# Altium schematic sheet Wenzel_Arduino.SchDoc: =SheetTitle_Top
size 420 x 297 mm; EDA_Number: ARTIQ; Projet: Wenzel; Author: G.Kasprowicz; CompanyName: WUT ISE; DrawnBy: G.Kasprowicz; Organization: WUT ISE; Address1: PW ISE; Address2: Nowowiejska 15/19 00-665 Warsaw; Address3: gkasprow@gmail.com; SheetNumber: -; SheetTotal: -; ModifiedBy: -; CheckedDate: -; Title2: Arduino; DivGrp: WUT ISE; Designer: G.Kasprowicz; ModifiedDate: -; ProjectName: Sensor Box
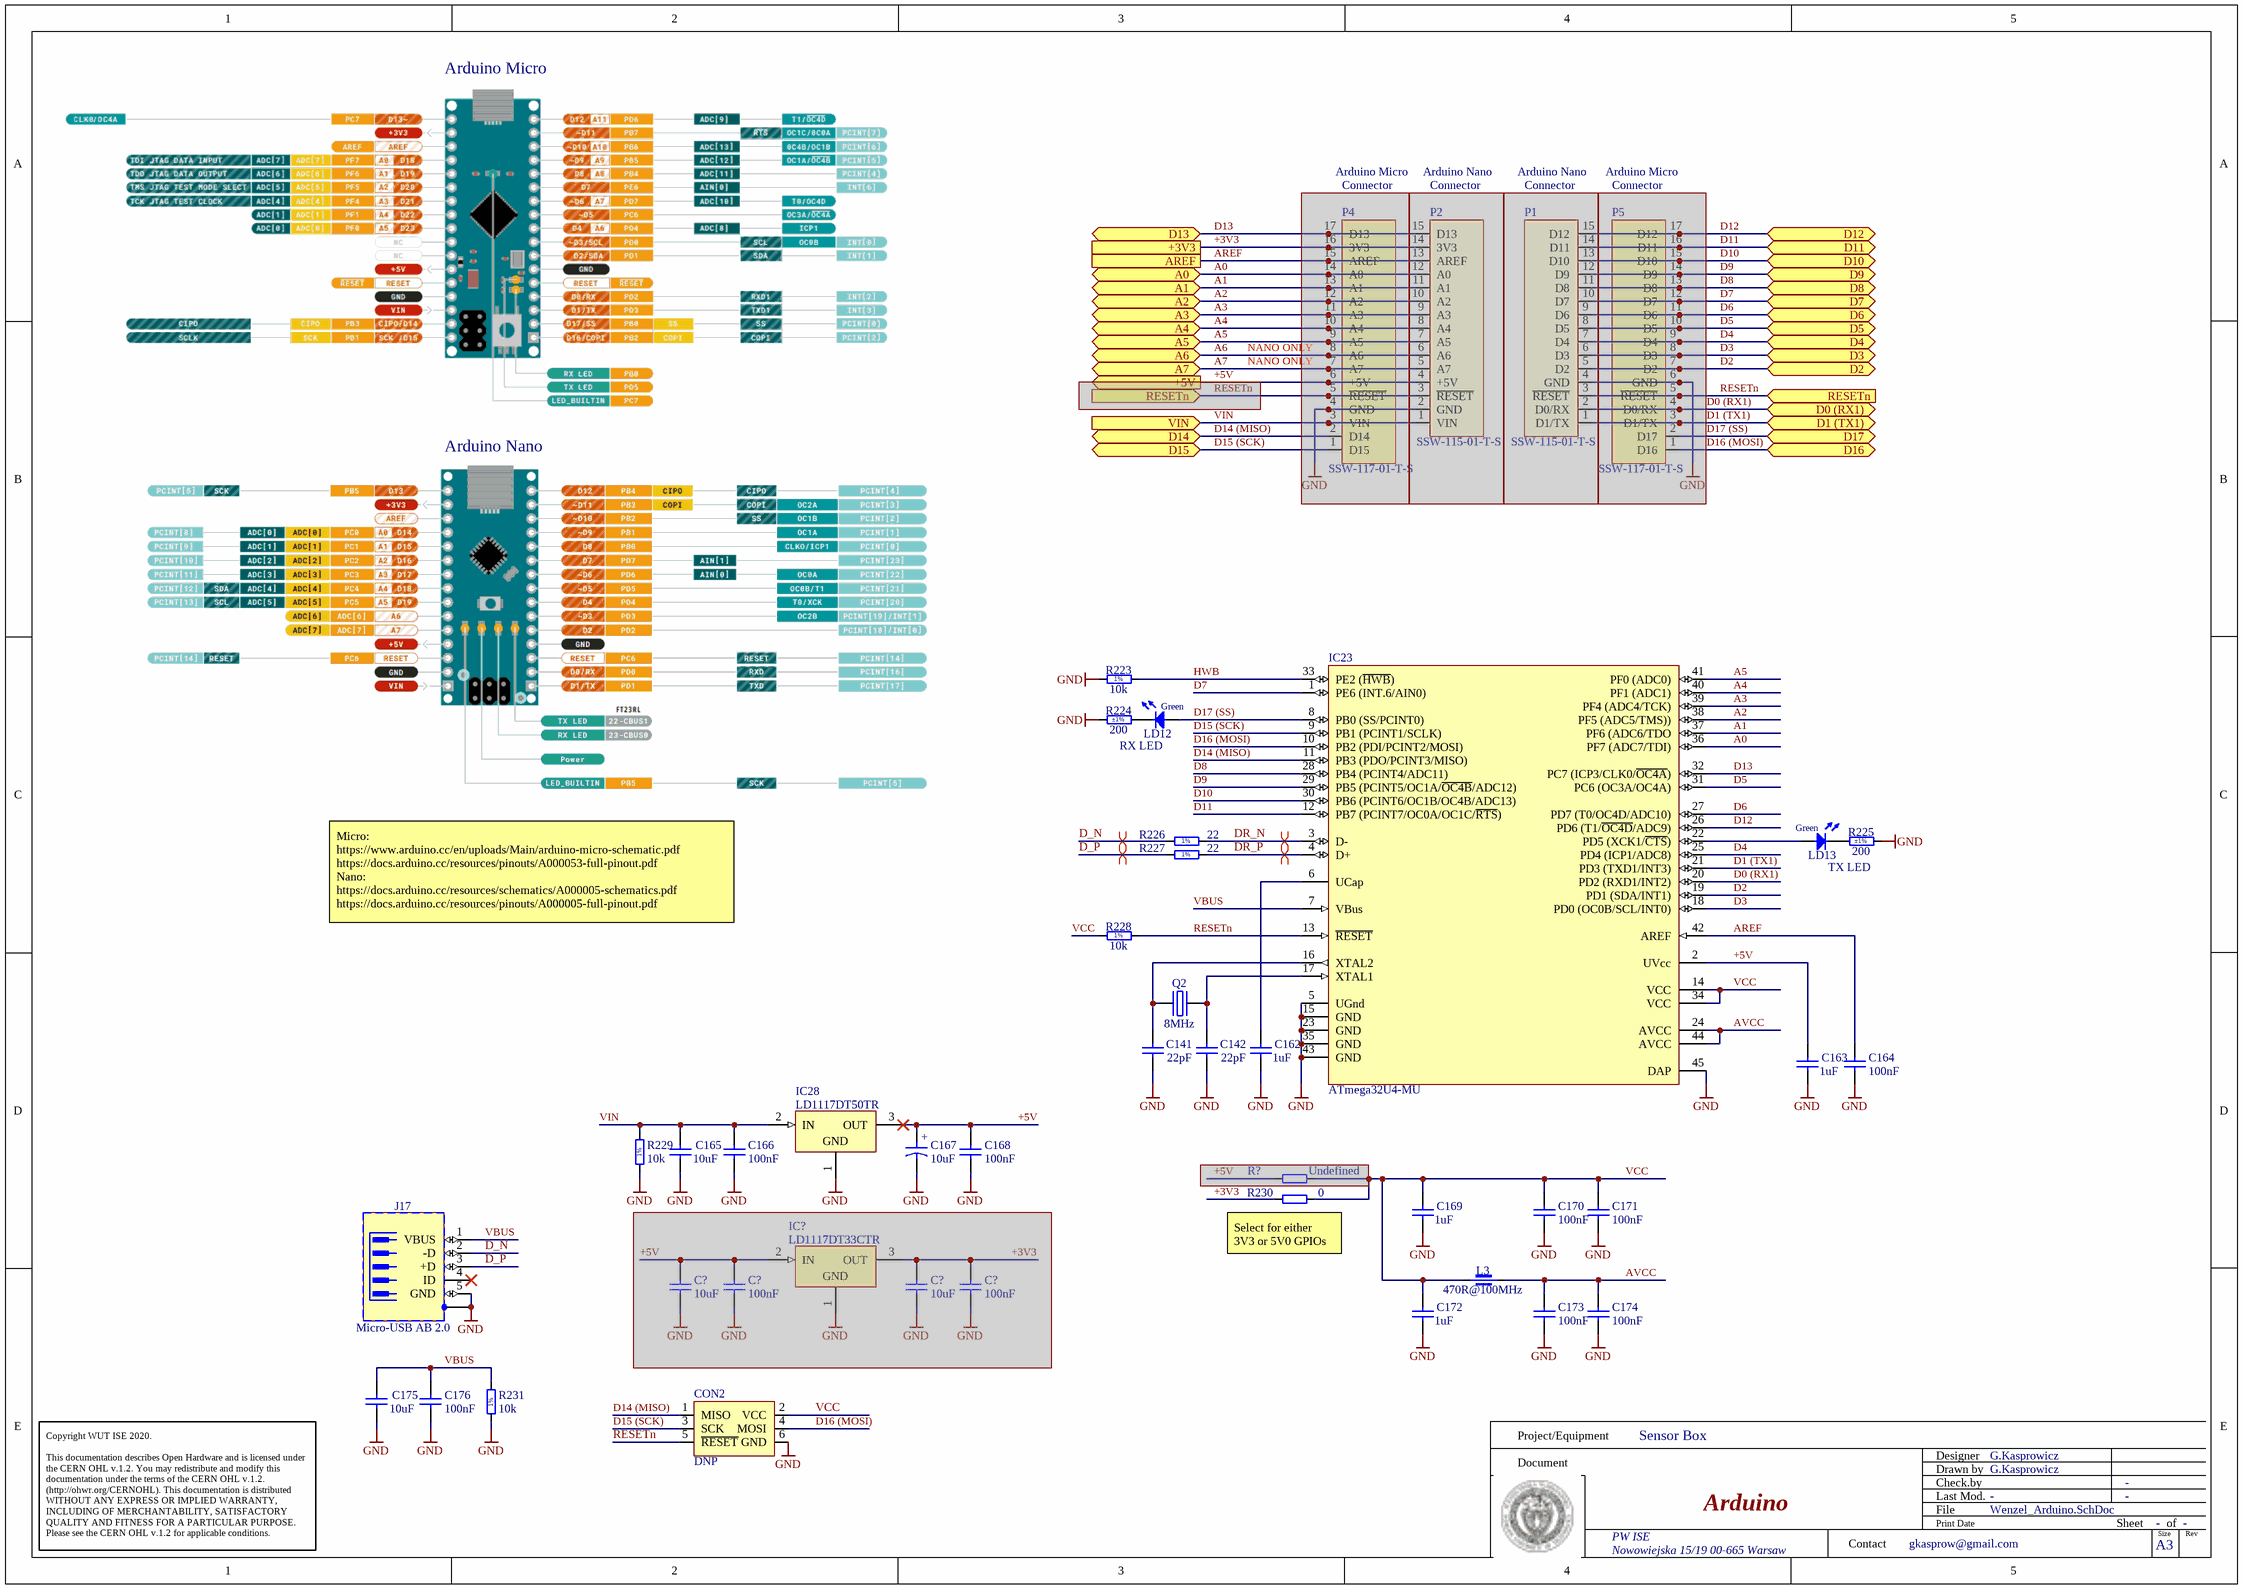
[diagram p0: Wenzel_Arduino.SchDoc]

## Parts
(Parts that share a designator on the sheet are numbered #1, #2 ... from top to bottom, then left to right.)
C141  22pF  [CAPC1005X55N]
C142  22pF  [CAPC1005X55N]
C162  1uF  [CAPC1005X55N]
C163  1uF  [CAPC1005X55N]
C164  100nF  [CAPC1005X55N]
C165  10uF  [CAPC1608X80N]
C166  100nF  [CAPC1005X55N]
C167  10uF  [CAPMP3216X180N]
C168  100nF  [CAPC1005X55N]
C169  1uF  [CAPC1005X55N]
C170  100nF  [CAPC1005X55N]
C171  100nF  [CAPC1005X55N]
C172  1uF  [CAPC1005X55N]
C173  100nF  [CAPC1005X55N]
C174  100nF  [CAPC1005X55N]
C175  10uF  [CAPC1608X80N]
C176  100nF  [CAPC1005X55N]
C?#1  100nF  [CAPC1608X87N]  (masked out: inside a compile mask, not in the netlist)
C?#2  100nF  [CAPC1608X87N]  (masked out: inside a compile mask, not in the netlist)
C?#3  10uF  [CAPC1608X80N]  (masked out: inside a compile mask, not in the netlist)
C?#4  10uF  [CAPC1608X80N]  (masked out: inside a compile mask, not in the netlist)
CON2  DNP  [HEADER3x2]
IC23  ATmega32U4-MU  [44PW_M]
IC28  LD1117DT50TR  [TO228P972X240-3N-R540X510]
IC?  LD1117DT33CTR  [TO228P972X240-3N-R540X510]  (masked out: inside a compile mask, not in the netlist)
J17  Micro-USB AB 2.0  [HIROSE_ZX62RD-AB-5P8]
L3  470R@100MHz  [INDC1608X95N]
LD12  Green  [LED_KINGBRIGHT_KPH-1608CGCK]
LD13  Green  [LED_KINGBRIGHT_KPH-1608CGCK]
P1  SSW-115-01-T-S  [SSW-115-01-T-S]  (masked out: inside a compile mask, not in the netlist)
P2  SSW-115-01-T-S  [SSW-115-01-T-S]  (masked out: inside a compile mask, not in the netlist)
P4  SSW-117-01-T-S  [SSW-117-01-T-S]  (masked out: inside a compile mask, not in the netlist)
P5  SSW-117-01-T-S  [SSW-117-01-T-S]  (masked out: inside a compile mask, not in the netlist)
Q2  8MHz  [XTAL_TXC_7A]
R223  10k  [RESC1608X55N]
R224  200  Tolerance: ±1%  [RESC1005X40N]
R225  200  Tolerance: ±1%  [RESC1005X40N]
R226  22  [RESC1005X40N]
R227  22  [RESC1005X40N]
R228  10k  [RESC1608X55N]
R229  10k  [RESC1608X55N]
R230  0  [RESC1005X40N]
R231  10k  [RESC1608X55N]
R?  Undefined  [RESC1005X40N]  (masked out: inside a compile mask, not in the netlist)

## Ports
+3V3, +5V (out), A0 (bidir), A1 (bidir), A2 (bidir), A3 (bidir), A4 (bidir), A5 (bidir), A6 (bidir), A7 (bidir), AREF, D0 (RX1) (bidir), D1 (TX1) (bidir), D2 (bidir), D3 (bidir), D4 (bidir), D5 (bidir), D6 (bidir), D7 (bidir), D8 (bidir), D9 (bidir), D10 (bidir), D11 (bidir), D12 (bidir), D13 (bidir), D14 (bidir), D15 (bidir), D16 (bidir), D17 (bidir), RESETn (in), VIN (in)

## Nets
GND: C141.1 C142.1 C162.1 C163.1 C164.1 C165.1 C166.1 C167.2 C168.1 C169.1 C170.1 C171.1 C172.1 C173.1 C174.1 C175.1 C176.1 CON2.6(GND) IC23.5(UGnd) IC23.15(GND) IC23.23(GND) IC23.35(GND) IC23.43(GND) IC23.45(DAP) IC28.1(GND) J17.5(GND) J17.6(SH) R223.1 R224.1 R225.2 R229.1 R231.1
+3V3: R230.2 ; port +3V3
+5V: C163.2 C167.1 C168.2 IC23.2(UVcc) IC28.3(OUT)
A0: IC23.36(PF7_(ADC7/TDI)) ; port A0
A1: IC23.37(PF6_(ADC6/TDO) ; port A1
A2: IC23.38(PF5_(ADC5/TMS))) ; port A2
A3: IC23.39(PF4_(ADC4/TCK)) ; port A3
A4: IC23.40(PF1_(ADC1)) ; port A4
A5: IC23.41(PF0_(ADC0)) ; port A5
A6: port A6
A7: port A7
AREF: C164.2 IC23.42(AREF) ; port AREF
AVCC: C173.2 C174.2 IC23.24(AVCC) IC23.44(AVCC) L3.2
D0 (RX1): IC23.20(PD2_(RXD1/INT2))
D1 (TX1): IC23.21(PD3_(TXD1/INT3))
D2: IC23.19(PD1_(SDA/INT1)) ; port D2
D3: IC23.18(PD0_(OC0B/SCL/INT0)) ; port D3
D4: IC23.25(PD4_(ICP1/ADC8)) ; port D4
D5: IC23.31(PC6_(OC3A/OC4A)) ; port D5
D6: IC23.27(PD7_(T0/OC4D/ADC10)) ; port D6
D7: IC23.1(PE6_(INT.6/AIN0)) ; port D7
D8: IC23.28(PB4_(PCINT4/ADC11)) ; port D8
D9: IC23.29(PB5_(PCINT5/OC1A/~{OC4B}/ADC12)) ; port D9
D10: IC23.30(PB6_(PCINT6/OC1B/OC4B/ADC13)) ; port D10
D11: IC23.12(PB7_(PCINT7/OC0A/OC1C/~{RTS})) ; port D11
D12: IC23.26(PD6_(T1/~{OC4D}/ADC9)) ; port D12
D13: IC23.32(PC7_(ICP3/CLK0/~{OC4A})) ; port D13
D14 (MISO): CON2.1(MISO) IC23.11(PB3_(PDO/PCINT3/MISO)) ; port D14
D15 (SCK): CON2.3(SCK) IC23.9(PB1_(PCINT1/SCLK)) ; port D15
D16 (MOSI): CON2.4(MOSI) IC23.10(PB2_(PDI/PCINT2/MOSI))
D17 (SS): IC23.8(PB0_(SS/PCINT0)) LD12.2(A)
D_N: J17.2(-D) R226.1
D_P: J17.3(+D) R227.1
DR_N: IC23.3(D-) R226.2
DR_P: IC23.4(D+) R227.2
HWB: IC23.33(PE2_(~{HWB})) R223.2
RESETn: CON2.5(~{RESET}) IC23.13(~{RESET}) R228.2 ; port RESETn
VBUS: C175.2 C176.2 IC23.7(VBus) J17.1(VBUS) R231.2
VCC: C169.2 C170.2 C171.2 C172.2 CON2.2(VCC) IC23.14(VCC) IC23.34(VCC) L3.1 R228.1 R230.1
VIN: C165.2 C166.2 IC28.2(IN) R229.2 ; port VIN
NetC141_2: C141.2 IC23.16(XTAL2) Q2.1(OSC1)
NetC142_2: C142.2 IC23.17(XTAL1) Q2.2(OSC2)
NetC162_2: C162.2 IC23.6(UCap)
NetIC23_22: IC23.22(PD5_(XCK1/~{CTS})) LD13.2(A)
NetLD12_1: LD12.1(C) R224.2
NetLD13_1: LD13.1(C) R225.1

Not connected (* = marked no-connect by the designer): J17 4(ID)*

## Layout directives
differential pair: D_N, D_P, DR_N, DR_P

## Notes on the sheet
- Arduino Micro
- Connector
- Arduino Nano
- (near P2) Connector
- (near P1) Connector
- (near P4) NANO ONLY
- RX LED
- Micro:
  https://www.arduino.cc/en/uploads/Main/arduino-micro-schematic.pdf
  https://docs.arduino.cc/resources/pinouts/A000053-full-pinout.pdf
  Nano:
  https://docs.arduino.cc/resources/schematics/A000005-schematics.pdf
  https://docs.arduino.cc/resources/pinouts/A000005-full-pinout.pdf
- TX LED
- (near R230) Select for either 3V3 or 5V0 GPIOs
- Project/Equipment
- Document
- Designer
- Drawn by
- Check.by
- Copyright WUT ISE 2020.
  This documentation describes Open Hardware and is licensed under the CERN OHL v.1.2. You may redistribute and modify this documentation under the terms of the CERN OHL v.1.2. (http://ohwr.org/CERNOHL). This documentation is distributed WITHOUT ANY EXPRESS OR IMPLIED WARRANTY, INCLUDING OF MERCHANTABILITY, SATISFACTORY QUALITY AND FITNESS FOR A PARTICULAR PURPOSE. Please see the CERN OHL v.1.2 for applicable conditions.
- Contact
- File
- Last Mod.
- Print Date
- Sheet
- Size
- A3
- of
- Rev
- (in symbol CTE3216-18_10UF_16V_20%_AVX_TCJ) +
- (in symbol R0402_22R_1%_0.0625W_100PPM) 1%
- (in symbol R0603_10K_1%_0.1W_100PPM) 1%

## Library data of the parts
C141 C142 = CC0402_22PF_50V_5%_C0G: Non-polarised capacitor; Part Description: SMD Multilayer Chip Ceramic Capacitor; Manufacturer: GENERIC; Manufacturer1 Part Number: C0402C220J5GACTU; Voltage: 50V; TC: C0G/NP0; Tolerance: ±5%; Part Number: CC0402_22PF_50V_5%_C0G; Component Kind: Standard; Component Type: Standard; Pin Count: 2; Value: 22pF; Status: Preferred; Manufacturer Part Number: CC0402_22PF_50V_5%_C0G; Case: 0402; Mounted: Yes; Socket: No; SMD: Yes; Manufacturer1 Example: KEMET; Manufacturer1 ComponentHeight: 0.55mm; HelpURL: \\cern.ch\dfs\Applications\Altium\Datasheets\CC0402_C0G_KEMET_(Commercial Grade).pdf; Author: CERN DEM JLC; CreateDate: 2007-12-03; LatestRevisionDate: 2007-12-03; Sense: No
C162 C163 C169 C172 = CC0402_1UF_16V_10%_X5R: Non-polarised capacitor; Part Description: SMD Multilayer Chip Ceramic Capacitor; Manufacturer: GENERIC; Manufacturer1 Part Number: C1005X5R1C105KT; Voltage: 16V; TC: X5R; Tolerance: ±10%; Part Number: CC0402_1UF_16V_10%_X5R; Component Kind: Standard; Component Type: Standard; Pin Count: 2; Value: 1uF; Status: Preferred; Manufacturer Part Number: CC0402_1UF_16V_10%_X5R; Case: 0402; Mounted: Yes; Socket: No; SMD: Yes; Sense: No; Manufacturer1 Example: TDK; Manufacturer1 ComponentHeight: 0.55mm; HelpURL: \\cern.ch\dfs\Applications\Altium\Datasheets\CC0402_X5R_TDK_C.pdf; Author: CERN DEM JLC; CreateDate: 2012-10-25; LatestRevisionDate: 2012-10-25
C164 C166 C168 C170 C171 C173 C174 C176 = CC0402_100NF_16V_10%_X5R: Non-polarised capacitor; Part Description: SMD Multilayer Chip Ceramic Capacitor; Manufacturer: GENERIC; Manufacturer1 Part Number: GRM155R61C104KA88D; Voltage: 16V; TC: X5R; Tolerance: ±10%; Part Number: CC0402_100NF_16V_10%_X5R; Component Kind: Standard; Component Type: Standard; Pin Count: 2; Value: 100nF; Status: None; Manufacturer Part Number: CC0402_100NF_16V_10%_X5R; Case: 0402; Mounted: Yes; Socket: No; SMD: Yes; Sense: No; Manufacturer1 Example: MURATA; Manufacturer1 ComponentHeight: 0.55mm; HelpURL: \\cern.ch\dfs\Applications\Altium\Datasheets\CC0402_X5R_MURATA_GRM.pdf; Author: CERN DEM JLC; CreateDate: 10.12.2013; LatestRevisionDate: 10.12.2013
C165 C175 = CC0603_10UF_16V_20%_X5R: Non-polarised capacitor; Part Description: SMD Multilayer Chip Ceramic Capacitor; Manufacturer: GENERIC; Manufacturer1 Part Number: GRM188R61C106MA73D; Voltage: 16V; TC: X5R; Tolerance: ±20%; Part Number: CC0603_10UF_16V_20%_X5R; Component Kind: Standard; Component Type: Standard; Pin Count: 2; Value: 10uF; Status: None; Manufacturer Part Number: CC0603_10UF_16V_20%_X5R; Case: 0603; Mounted: Yes; Socket: No; SMD: Yes; Sense: No; Manufacturer1 Example: MURATA; Manufacturer1 ComponentHeight: 0.8mm; HelpURL: \\cern.ch\dfs\Applications\Altium\Datasheets\CC0603_X5R_MURATA_GRM.pdf; Author: CERN DEM MR; CreateDate: 02.03.2016; LatestRevisionDate: 02.03.2016
C167 = CTE3216-18_10UF_16V_20%_AVX_TCJ: Polarised capacitor; Part Description: ESR 0R200 Tantalum Solid Electrolytic Chip Capacitor with Conductive Polymer Electrode; Manufacturer: AVX; Manufacturer Part Number: TCJA106M016R0200 or  or TR3A106K016C1700; Voltage: 16V; Tolerance: ±20%; Part Number: CTE3216-18_10UF_16V_20%_AVX_TCJ; Component Kind: Standard; Component Type: Standard; Pin Count: 2; Value: 10uF; Status: Preferred; Case: A; Mounted: Yes; Socket: No; SMD: Yes; Sense: No; HelpURL: \\cern.ch\dfs\Applications\Altium\Datasheets\CTE_AVX_TCJ.pdf; Author: CERN DEM JLC; CreateDate: 29.03.2012; LatestRevisionDate: 29.03.2012; ComponentHeight: 1.8mm
C?#1 C?#2 = CC0603_100NF_50V_10%_X5R: Non-polarised capacitor; Part Description: SMD Multilayer Chip Ceramic Capacitor; Manufacturer: GENERIC; Manufacturer1 Part Number: C1608X5R1H104K080AA; Voltage: 50V; TC: X5R; Tolerance: ±10%; Part Number: CC0603_100NF_50V_10%_X5R; Component Kind: Standard; Component Type: Standard; Pin Count: 2; Value: 100nF; Status: None; Manufacturer Part Number: CC0603_100NF_50V_10%_X5R; Case: 0603; Mounted: Yes; Socket: No; SMD: Yes; Sense: No; Manufacturer1 Example: TDK; Manufacturer1 ComponentHeight: 0.9mm; HelpURL: \\cern.ch\dfs\Applications\Altium\Datasheets\CC0603_X5R_TDK_C.pdf; Author: CERN DEM MR; CreateDate: 08.01.2016; LatestRevisionDate: 08.01.2016
C?#3 C?#4 = CC0603_10UF_10V_10%_X5R: Non-polarised capacitor; Part Description: SMD Multilayer Chip Ceramic Capacitor; Manufacturer: GENERIC; Manufacturer1 Part Number: GRM188R61A106KE69D; Voltage: 10V; TC: X5R; Tolerance: ±10%; Part Number: CC0603_10UF_10V_10%_X5R; Component Kind: Standard; Component Type: Standard; Pin Count: 2; Value: 10uF; Status: None; Manufacturer Part Number: CC0603_10UF_10V_10%_X5R; Case: 0603; Mounted: Yes; Socket: No; SMD: Yes; Sense: No; Manufacturer1 Example: MURATA; Manufacturer1 ComponentHeight: 0.8mm; HelpURL: \\cern.ch\dfs\Applications\Altium\Datasheets\CC0603_MURATA_GRM188R61A106KE69D.pdf; Author: CERN DEM JLC; CreateDate: 31.01.2017; LatestRevisionDate: 31.01.2017
CON2 = CON_ISP: 6x 2.54mm SMT  dual row pin header
IC23 = CMP-0095-00166-2: 8-bit AVR Microcontroller, 2.7-5.5V, 16MHz, 32KB Flash, 1KB EEPROM, 2.5KB SRAM, USB Controller, 44-pin QFN, Industrial Grade (-40°C to 85°C), Ext Osc; Manufacturer: Microchip; PackageVersion: revG, Sep-2009; PackageReference: 44PW; ComponentLink1URL: http://www.atmel.com/; PackageDescription: 44-Pin Quad Flat No-Lead Package, 7 x 7 mm Body, 0.5 mm Pitch (QFN); ComponentLink3Description: ATmega16U4 ATmega32U4 Summary; RevisionNote: DatasheetVersion, PackageVersion & PCB updated. URLs added.; ComponentLink2Description: ATmega16U4/32U4 Datasheet; ComponentLink1Description: Manufacturer URL; ComponentLink3URL: http://www.atmel.com/dyn/resources/prod_documents/7766S.pdf; DatasheetVersion: revF, Nov-2010; ComponentLink2URL: http://www.atmel.com/dyn/resources/prod_documents/doc7766.pdf; Code_JEDEC: MO-220-VKKD-1; Part Number: ATmega32U4-MU; Manufacturer Part Number: ATmega32U4-MU
IC28 = LD1117DT50TR: 3-Terminal Regulator 1=GND 2=IN 3=OUT; Part Description: 5V 800mA Low drop fixed positive voltage regulators; Manufacturer: ST MICROELECTRONICS; PressFit: No; Bonding: No; Part Number: LD1117DT50TR; Component Kind: Standard; Component Type: Standard; Device: LD1117DT50TR; PackageDescription: TO-252 DPAK TO, 2.28mm Pitch; 2 Pin, 9.725mm L X 6.10mm W X 2.40mm H body, IPC Medium Density; Manufacturer Part Number: LD1117DT50TR; Pin Count: 3; Case: DPAK; Mounted: Yes; Socket: No; SMD: Yes; Sense: No; ComponentHeight: 2.4mm; HelpURL: \\cern.ch\dfs\Applications\Altium\Datasheets\LD1117DT50TR.pdf; Author: CERN DEM JLC; CreateDate: 20/09/2010; LatestRevisionDate: 20/09/2010
IC? = LD1117DT33CTR: 3-Terminal Regulator 1=GND 2=IN 3=OUT; Part Description: 3.3V 800mA Low drop fixed and adjustable positive voltage regulators; Manufacturer: ST MICROELECTRONICS; PressFit: No; Bonding: No; Part Number: LD1117DT33CTR; Component Kind: Standard; Component Type: Standard; Device: LD1117DT33CTR; PackageDescription: DPAK TO-252, 2.28mm pitch; 2 pin, 9.725mm L X 6.10mm W X 2.40mm H body, IPC Medium Density; Manufacturer Part Number: LD1117DT33CTR; Pin Count: 3; Case: DPAK; Mounted: Yes; Socket: No; SMD: Yes; Sense: No; ComponentHeight: 2.4mm; HelpURL: \\cern.ch\dfs\Applications\Altium\Datasheets\LD1117DT33CTR.pdf; Author: CERN DEM JLC; CreateDate: 08.06.2011; LatestRevisionDate: 08.06.2011
J17 = HIROSE_ZX62RD-AB-5P8: 5 Pin + 1 Shield USB Receptacle; Part Description: Micro-USB 2.0 Right Angle, SMD Type AB - Reverse (Top mount), Shell Through Hole; Manufacturer: HIROSE (HRS); PressFit: No; Part Number: HIROSE_ZX62RD-AB-5P8; Component Kind: Standard; Component Type: Standard; Pin Count: 7; Family: Micro-USB AB 2.0; Mounted: Yes; Socket: No; SMD: Yes; Sense: No; Status: None; Manufacturer Part Number: ZX62RD-AB-5P8; ComponentHeight: 2.35mm; HelpURL: \\cern.ch\dfs\Applications\Altium\Datasheets\HIROSE_ZX62RD-AB-5P8.pdf; ComponentLink1URL: \\cern.ch\dfs\Applications\Altium\Datasheets\HIROSE_ZX62RD-AB-5P8_Package-Drawing.pdf; ComponentLink1Description: Package-Drawing; Author: CERN DEM JLC; CreateDate: 29.10.2014; LatestRevisionDate: 29.10.2014; ClassName: Connectors
L3 = IND0603_MURATA_BLM18PG471SN1D: Part Description: SMD EMIFIL Chip Ferrite Bead; Manufacturer: MURATA; Power: 1A; Resistance: 0.2R; Tolerance: ±25%; Part Number: IND0603_MURATA_BLM18PG471SN1D; Component Kind: Standard; Component Type: Standard; Pin Count: 2; Value: 470R@100MHz; Manufacturer Part Number: BLM18PG471SN1D; Case: 0603; Mounted: Yes; Socket: No; SMD: Yes; Sense: No; ComponentHeight: 0.95mm; HelpURL: \\cern.ch\dfs\Applications\Altium\Datasheets\IND0603_MURATA_BLM18P.pdf; Author: CERN DEM BC; CreateDate: 17.02.2021; LatestRevisionDate: 17.02.2021
LD12 LD13 = LED_KINGBRIGHT_KPH-1608CGCK: LED Green 1C 2A; Part Description: SMD Green LED, Case 1.6mmX0.8mm(0603), 0.65mm Thickness; PressFit: No; Bonding: No; Part Number: LED_KINGBRIGHT_KPH-1608CGCK; Component Kind: Standard; Component Type: Standard; Color: Green; PackageDescription: SMT Green LED, Case 0603, Body L 1.6 x W 0.8mm H 0.65mm; Manufacturer: KINGBRIGHT; Manufacturer Part Number: KPH-1608CGCK; Pin Count: 2; Mounted: Yes; Socket: No; SMD: Yes; Sense: No; ComponentHeight: 0.65mm; HelpURL: \\cern.ch\dfs\Applications\Altium\Datasheets\LED_KINGBRIGHT_KPH-1608CGCK.pdf; Author: CERN DEM JLC; CreateDate: 03.07.2017; LatestRevisionDate: 03.07.2017
P1 = Arduino_Nano_Socket_A: Manufacturer1: Samtec; Part Number: SSW-115-01-T-S; Manufacturer1 Part Number: SSW-115-01-T-S
P2 = Arduino_Nano_Socket_B: Manufacturer1: Samtec; Part Number: SSW-115-01-T-S; Manufacturer1 Part Number: SSW-115-01-T-S
P4 = Arduino_Micro_Socket_B: Manufacturer1: Samtec; Part Number: SSW-117-01-T-S; Manufacturer1 Part Number: SSW-117-01-T-S
P5 = Arduino_Micro_Socket_A: Manufacturer1: Samtec; Part Number: SSW-117-01-T-S; Manufacturer1 Part Number: SSW-117-01-T-S
Q2 = XTAL_8MHZ_TXC_7A-8.000MAAE-T: Quartz Crystal; Part Description: Tolerance: ±30ppm, Stability: ±30ppm, -20°C to +70°C, 12pF, SMD Glass Seam Sealing Crystal, 7A Series; Manufacturer: TXC CORPORATION; PressFit: No; Bonding: No; Part Number: XTAL_8MHZ_TXC_7A-8.000MAAE-T; Component Kind: Standard; Component Type: Standard; PackageDescription: 2 Pins, 3.2x5mm, SMD Glass Seam Sealing Crystal, 7A Serie; Value: 8MHz; Manufacturer Part Number: 7A-8.000MAAE-T; Pin Count: 2; Mounted: Yes; Socket: No; SMD: Yes; Sense: No; ComponentHeight: 1.2mm; HelpURL: \\cern.ch\dfs\Applications\Altium\Datasheets\XTAL_TXC_7A.pdf; Author: CERN DEM JLC; CreateDate: 09.10.2014; LatestRevisionDate: 12.11.2014
R223 R228 R229 R231 = R0603_10K_1%_0.1W_100PPM: Resistor - 1%; Part Description: General Purpose Thick Film Chip Resistor; Manufacturer: GENERIC; Manufacturer1 Part Number: NRC06F1002TRF; Power: 0.1W; TC: ±100ppm/°C; PressFit: No; Part Number: R0603_10K_1%_0.1W_100PPM; Component Kind: Standard; Component Type: Standard; Pin Count: 2; Value: 10k; Status: Preferred; Tolerance: ±1%; Manufacturer Part Number: R0603_10K_1%_0.1W_100PPM; Case: 0603; Mounted: Yes; Sense: No; Socket: No; SMD: Yes; Manufacturer1 Example: NIC COMPONENT; Manufacturer1 ComponentHeight: 0.55mm; HelpURL: \\cern.ch\dfs\Applications\Altium\Datasheets\R0603_NIC_NRC.pdf; Author: CERN DEM JLC; CreateDate: 03.12.2007; LatestRevisionDate: 13.03.2008
R224 R225 = R0402_200R_1%_0.0625W_100PPM: Resistor - 1%; Part Description: General Purpose Thick Film Chip Resistor; Manufacturer: GENERIC; Manufacturer1 Part Number: 232270672001L; TC: ±100ppm/°C; PressFit: No; Part Number: R0402_200R_1%_0.0625W_100PPM; Component Kind: Standard; Component Type: Standard; Pin Count: 2; Value: 200; Status: Not Recommended; Power: 0.0625W; Manufacturer Part Number: R0402_200R_1%_0.0625W_100PPM; Case: 0402; Mounted: Yes; Sense: No; Socket: No; SMD: Yes; Manufacturer1 Example: YAGEO PHYCOMP; Manufacturer1 ComponentHeight: 0.4mm; HelpURL: \\cern.ch\dfs\Applications\Altium\Datasheets\R0402_Phycomp_RC0402.pdf; Author: CERN DEM JLC; CreateDate: 03.12.2007; LatestRevisionDate: 17.10.2012
R226 R227 = R0402_22R_1%_0.0625W_100PPM: Resistor - 1%; Part Description: General Purpose Thick Film Chip Resistor; Manufacturer: GENERIC; Manufacturer1 Part Number: 232270672209L; PressFit: No; Part Number: R0402_22R_1%_0.0625W_100PPM; Component Kind: Standard; Component Type: Standard; Pin Count: 2; Value: 22; Status: Not Recommended; Power: 0.0625W; Tolerance: ±1%; Manufacturer Part Number: R0402_22R_1%_0.0625W_100PPM; Case: 0402; Mounted: Yes; Socket: No; SMD: Yes; Manufacturer1 Example: YAGEO PHYCOMP; Manufacturer1 ComponentHeight: 0.4mm; HelpURL: \\cern.ch\dfs\Applications\Altium\Datasheets\R0402_Phycomp_RC0402.pdf; Author: CERN DEM JLC; CreateDate: 03.12.2007; LatestRevisionDate: 17.10.2012; Sense: No
R230 = R0402_0R_JUMPER: Resistor; Part Description: 1A (0.05R Max DC Resistance) Zero Ohm Jumper; Manufacturer: GENERIC; Manufacturer1 Part Number: 232270591001L; PressFit: No; Part Number: R0402_0R_JUMPER; Component Kind: Standard; Component Type: Standard; Pin Count: 2; Value: 0; Status: Not Recommended; Manufacturer Part Number: R0402_0R_JUMPER; Case: 0402; Mounted: Yes; Socket: No; SMD: Yes; Manufacturer1 Example: YAGEO PHYCOMP; Manufacturer1 ComponentHeight: 0.4mm; HelpURL: \\cern.ch\dfs\Applications\Altium\Datasheets\R0402_Phycomp_RC0402.pdf; Author: CERN DEM JLC; CreateDate: 03.12.2007; LatestRevisionDate: 17.10.2012; Sense: No
R? = R0402_NO-VALUE: Resistor; Part Description: Reserved Footprint For a 0402 (1005) Chip Resistor; Mounted: No; Part Number: R0402_NO-VALUE; Component Kind: Standard; Component Type: Standard; Pin Count: 2; Value: Undefined; Status: None; Manufacturer: Undefined; Manufacturer Part Number: R0402_NO-VALUE; Case: 0402; Sense: No; Socket: No; SMD: Yes; Manufacturer1 Example: Undefined; Manufacturer1 Part Number: Undefined; Manufacturer1 ComponentHeight: Undefined; HelpURL: Undefined; Author: CERN DEM JLC; CreateDate: 03.12.2007; LatestRevisionDate: 13.03.2008